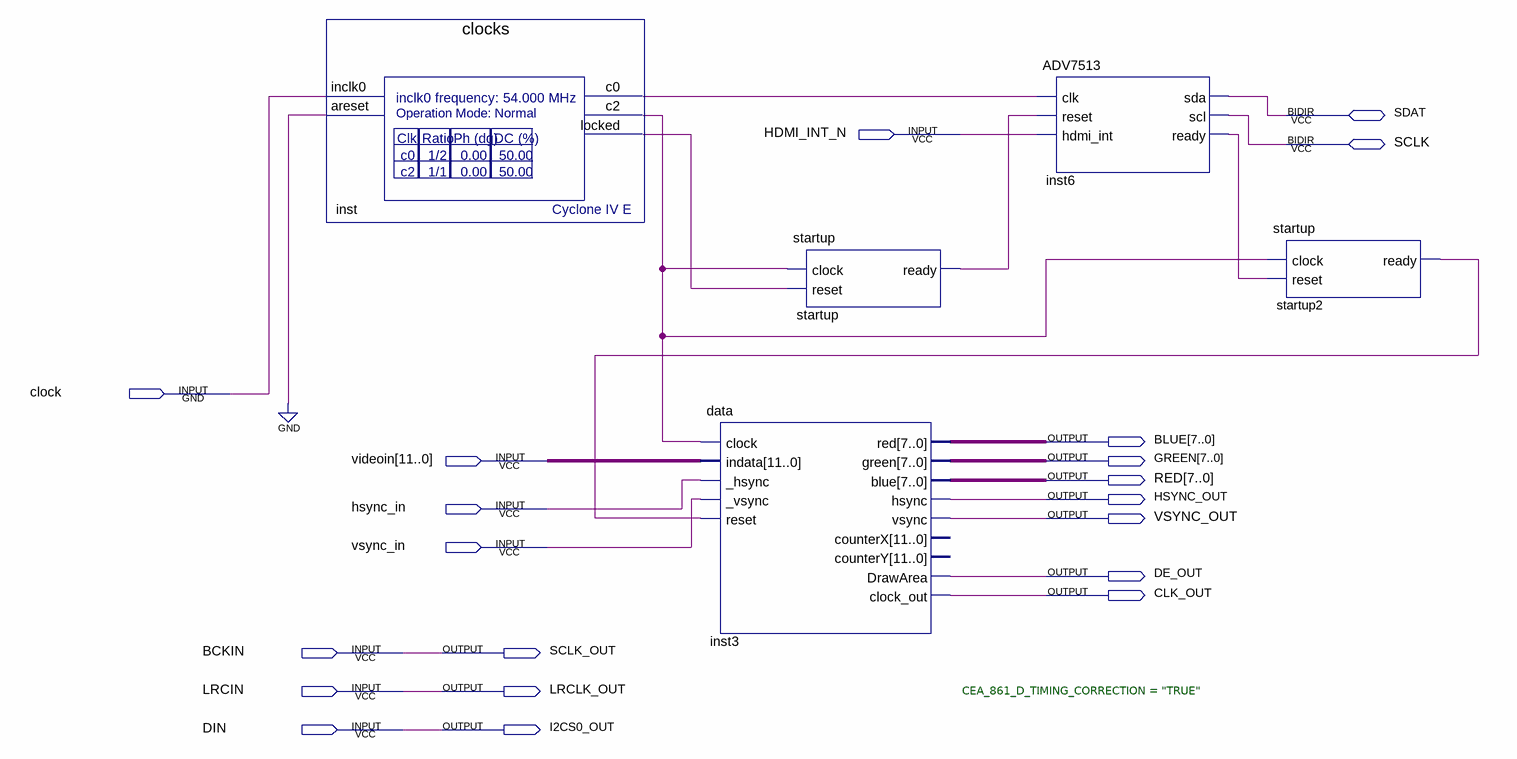
[diagram p0: schematic sheet]
// Quartus schematic Top.bdf as structural Verilog: 5 symbols, 20 pins
module Top (
  input  HDMI_INT_N,
  input  clock,
  input  [11:0] videoin,
  input  hsync_in,
  input  vsync_in,
  input  BCKIN,
  input  LRCIN,
  input  DIN,
  inout  SDAT,
  inout  SCLK,
  output [7:0] BLUE,
  output [7:0] GREEN,
  output [7:0] RED,
  output HSYNC_OUT,
  output VSYNC_OUT,
  output DE_OUT,
  output CLK_OUT,
  output SCLK_OUT,
  output LRCLK_OUT,
  output I2CS0_OUT
);

  wire inst6_ready, inst_c0, inst_c2, inst_locked, startup2_ready, startup_ready;

  clocks inst (.inclk0(clock), .areset(1'b0), .c0(inst_c0), .c2(inst_c2), .locked(inst_locked));
  data #(.CEA_861_D_TIMING_CORRECTION("TRUE")) inst3 (
    .clock(inst_c2), .indata(videoin), ._hsync(hsync_in), ._vsync(vsync_in), .reset(startup2_ready),
    .red(BLUE), .green(GREEN), .blue(RED), .hsync(HSYNC_OUT), .vsync(VSYNC_OUT), .DrawArea(DE_OUT),
    .clock_out(CLK_OUT));  // open: counterX, counterY
  startup startup (.clock(inst_c2), .reset(inst_locked), .ready(startup_ready));
  ADV7513 inst6 (
    .clk(inst_c0), .reset(startup_ready), .hdmi_int(HDMI_INT_N), .ready(inst6_ready), .sda(SDAT), .scl(SCLK));
  startup startup2 (.clock(inst_c2), .reset(inst6_ready), .ready(startup2_ready));

  assign I2CS0_OUT = DIN;
  assign LRCLK_OUT = LRCIN;
  assign SCLK_OUT = BCKIN;
endmodule
